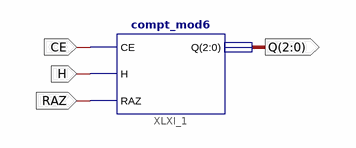
[diagram p0: schematic sheet 1]
// Xilinx ISE schematic modulo_6.sch (artix7) as structural Verilog: 1 symbols, 4 ports
module modulo_6 (
  input  CE,
  input  H,
  input  RAZ,
  output [2:0] Q
);

  compt_mod6 XLXI_1 (.CE(CE), .H(H), .Q(Q), .RAZ(RAZ));
endmodule
